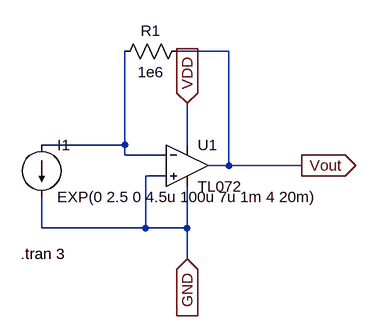
[diagram p0: schematic recepteur_IU_conv.asc]
recepteur_IU_conv.asc, the LTspice schematic file:
Version 4
SHEET 1 880 680
WIRE 256 -32 176 -32
WIRE 96 112 96 -32
WIRE 96 112 -32 112
WIRE 192 112 192 48
WIRE 96 128 96 112
WIRE 160 128 96 128
WIRE 256 144 256 -32
WIRE 256 144 224 144
WIRE 368 144 256 144
WIRE 160 160 128 160
WIRE -32 240 -32 192
WIRE 128 240 128 160
WIRE 128 240 -32 240
WIRE 192 240 192 176
WIRE 192 240 128 240
WIRE 192 288 192 240
FLAG 192 48 VDD
IOPIN 192 48 In
FLAG 368 144 Vout
IOPIN 368 144 Out
FLAG 192 288 GND
IOPIN 192 288 In
SYMBOL TL072 192 80 R0
SYMATTR InstName U1
SYMBOL current -32 112 R0
WINDOW 123 0 0 Left 0
WINDOW 39 0 0 Left 0
SYMATTR InstName I1
SYMATTR Value EXP(0 2.5 0 4.5u 100u 7u 1m 4 20m)
SYMBOL res 192 -48 R90
WINDOW 0 0 56 VBottom 2
WINDOW 3 32 56 VTop 2
SYMATTR InstName R1
SYMATTR Value 1e6
TEXT -64 280 Left 2 !.tran 3

The netlist it stands for:
* recepteur_IU_conv.asc
* U1: TL072 (symbol TL072 not available, pins judged from their places): In+=GND In-=N001 V+=VDD V-=GND OUT=Vout
I1 N001 GND EXP(0 2.5 0 4.5u 100u 7u 1m 4 20m)
R1 Vout N001 1e6
.tran 3
.backanno
.end